# EAGLE schematic rc2usb_led (EAGLE 6.3)
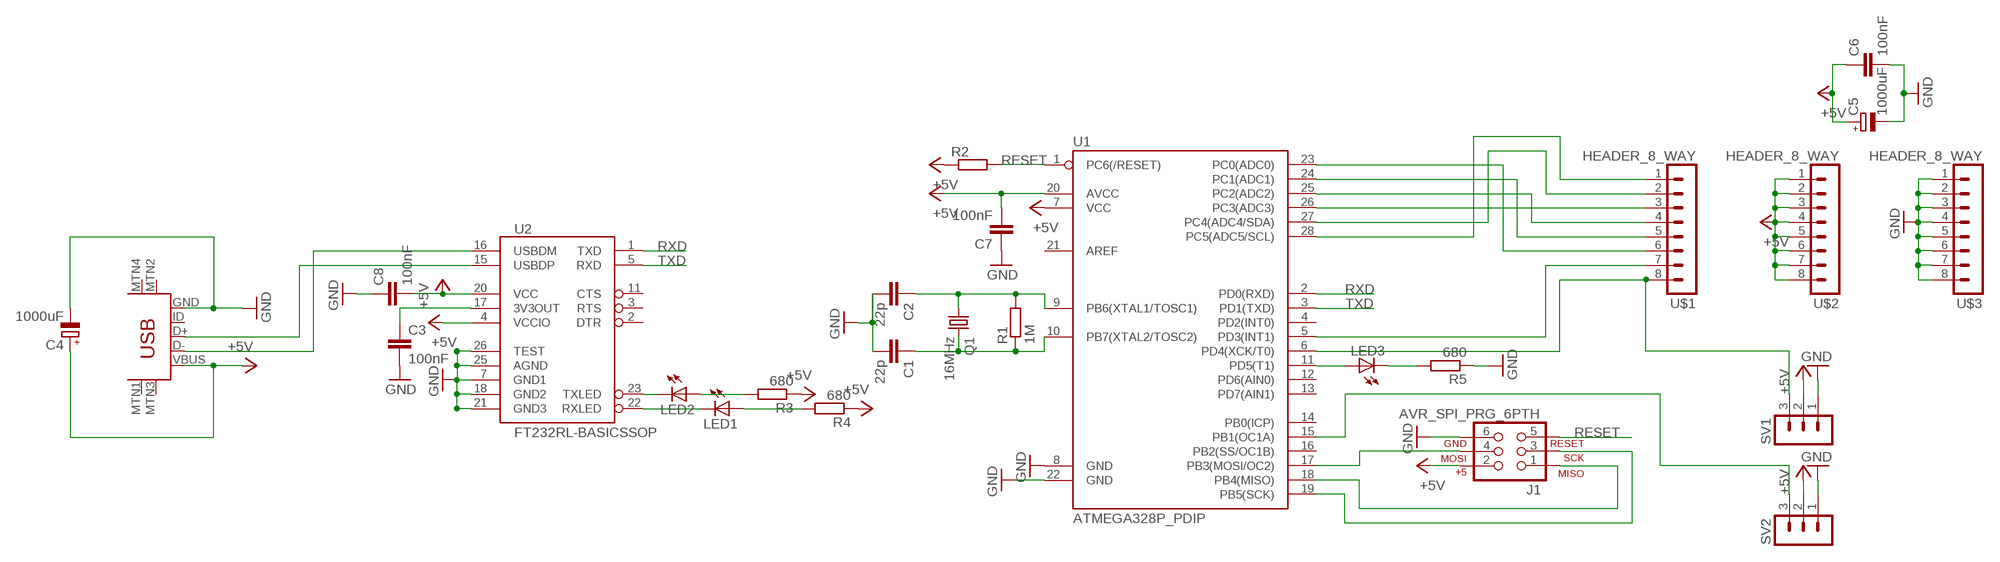
[diagram p0: schematic, sheet 1]

## Parts
C1  22p  C-EU025-040X050  [C025-040X050]
C2  22p  C-EU025-040X050  [C025-040X050]
C3  100nF  C-EU025-030X050  [C025-030X050]
C4  1000uF  CPOL-EUE5-10.5  [E5-10,5]
C5  1000uF  CPOL-EUE5-10.5  [E5-10,5]
C6  100nF  C-EU025-030X050  [C025-030X050]
C7  100nF  C-EU025-030X050  [C025-030X050]
C8  100nF  C-EU025-030X050  [C025-030X050]
J1  AVR_SPI_PRG_6PTH  [2X3]
LED1  LED5MM  [LED5MM]
LED2  LED5MM  [LED5MM]
LED3  LED5MM  [LED5MM]
Q1  16MHz  CRYSTALHC49U70  [HC49U70]
R1  1M  R-EU_0207/10  [0207/10]
R2  R-EU_0207/10  [0207/10]
R3  680  R-EU_0207/10  [0207/10]
R4  680  R-EU_0207/10  [0207/10]
R5  680  R-EU_0207/10  [0207/10]
SV1  MA03-1  [MA03-1]
SV2  MA03-1  [MA03-1]
U1  ATMEGA328P_PDIP  [DIL28-3]
U2  FT232RL-BASICSSOP  [SSOP28DB]
U$1  HEADER_8_WAY  [HEADER_8_WAY]
U$2  HEADER_8_WAY  [HEADER_8_WAY]
U$3  HEADER_8_WAY  [HEADER_8_WAY]
U$4  USB-MINIB-5PIN  [USB-MINIB]

## Nets
+5V: C4.+ C5.+ C6.1 C7.2 C8.2 J1.2 R2.1 R3.1 R4.1 SV1.2 SV2.2 U1.7(VCC) U1.20(AVCC) U2.4(VCCIO) U2.20(VCC) U$2.1 U$2.2 U$2.3 U$2.4 U$2.5 U$2.6 U$2.7 U$2.8 U$4.VBUS
GND: C1.2 C2.2 C3.2 C4.- C5.- C6.2 C7.1 C8.1 J1.6 R5.1 SV1.1 SV2.1 U1.8(GND) U1.22(GND) U2.7(GND1) U2.18(GND2) U2.21(GND3) U2.25(AGND) U2.26(TEST) U$3.1 U$3.2 U$3.3 U$3.4 U$3.5 U$3.6 U$3.7 U$3.8 U$4.GND
N$1: C2.1 Q1.1 R1.2 U1.9(PB6(XTAL1/TOSC1))
N$2: C1.1 Q1.2 R1.1 U1.10(PB7(XTAL2/TOSC2))
N$3: J1.4 U1.17(PB3(MOSI/OC2))
N$4: J1.1 U1.18(PB4(MISO))
N$5: J1.3 U1.19(PB5(SCK))
N$6: U2.15(USBDP) U$4.D+
N$7: U2.16(USBDM) U$4.D-
N$8: U1.24(PC1(ADC1)) U$1.5
N$9: C3.1 U2.17(3V3OUT)
N$10: LED2.K(C) U2.23(TXLED)
N$11: LED2.A R3.2
N$12: LED1.K(C) U2.22(RXLED)
N$13: LED1.A R4.2
N$14: U1.25(PC2(ADC2)) U$1.4
N$15: U1.26(PC3(ADC3)) U$1.3
N$16: U1.23(PC0(ADC0)) U$1.6
N$17: U1.27(PC4(ADC4/SDA)) U$1.2
N$18: U1.28(PC5(ADC5/SCL)) U$1.1
N$19: U1.5(PD3(INT1)) U$1.7
N$20: SV1.3 U1.6(PD4(XCK/T0)) U$1.8
N$21: LED3.A U1.11(PD5(T1))
N$22: SV2.3 U1.15(PB1(OC1A))
N$23: LED3.K(C) R5.2
RESET: J1.5 R2.2 U1.1(PC6(/RESET))
RXD: U1.2(PD0(RXD)) U2.1(TXD)
TXD: U1.3(PD1(TXD)) U2.5(RXD)
Unconnected: U1.4(PD2(INT0)) U1.12(PD6(AIN0)) U1.13(PD7(AIN1)) U1.14(PB0(ICP)) U1.16(PB2(SS/OC1B)) U1.21(AREF) U2.2(DTR) U2.3(RTS) U2.11(CTS) U$4.ID U$4.MTN1(MTN2) U$4.MTN2(MTN3) U$4.MTN3(MTN1) U$4.MTN4

## Library data of the parts
C1 C2 = resistor:C-EU: CAPACITOR, European symbol
C3 C6-C8 = rcl:C-EU: CAPACITOR, European symbol
C4 C5 = rcl:CPOL-EU: POLARIZED CAPACITOR, European symbol
J1 = SparkFun-Connectors:AVR_SPI_PRG_6: AVR ISP 6 Pin This is the reduced ISP connector for AVR programming. Common on Arduino. This footprint will take up less PCB space and can be used with a 10-pin to 6-pin adapter such as SKU: BOB-08508
LED1-LED3 = led:LED: LED OSRAM: - CHIPLED LG R971, LG N971, LY N971, LG Q971, LY Q971, LO R971, LY R971 LH N974, LH R974 LS Q976, LO Q976, LY Q976 LO Q996 - Hyper CHIPLED LW Q18S LB Q993, LB Q99A, LB R99A - SideLED LS A670, LO A670, LY A670, LG A670, LP A670 LB A673, LV A673, LT A673, LW A673 LH A674 LY A675 LS A676, LA A676, LO A676, LY A676, LW A676 LS A679, LY A679, LG A679 - Hyper Micro SIDELED® LS Y876, LA Y876, LO Y876, LY Y876 LT Y87S - SmartLED LW L88C, LW L88S LB L89C, LB L89S, LG L890 LS L89K, LO L89K, LY L89K LS L896, LA L896, LO L896, LY L896 - TOPLED LS T670, LO T670, LY T670, LG T670, LP T670 LSG T670, LSP T670, LSY T670, LOP T670, LYG T670 LG T671, LOG T671, LSG T671 LB T673, LV T673, LT T673, LW T673 LH T674 LS T676, LA T676, LO T676, LY T676, LB T676, LH T676, LSB T676, LW T676 LB T67C, LV T67C, LT T67C, LS T67K, LO T67K, LY T67K, LW E67C LS E67B, LA E67B, LO E67B, LY E67B, LB E67C, LV E67C, LT E67C LW T67C LS T679, LY T679, LG T679 LS T770, LO T770, LY T770, LG T770, LP T770 LB T773, LV T773, LT T773, LW T773 LH T774 LS E675, LA E675, LY E675, LS T675 LS T776, LA T776, LO T776, LY T776, LB T776 LHGB T686 LT T68C, LB T68C - Hyper Mini TOPLED® LB M676 - Mini TOPLED Santana® LG M470 LS M47K, LO M47K, LY M47K Source: http://www.osram.convergy.de LUXEON: - LUMILED® LXK2-PW12-R00, LXK2-PW12-S00, LXK2-PW14-U00, LXK2-PW14-V00 LXK2-PM12-R00, LXK2-PM12-S00, LXK2-PM14-U00 LXK2-PE12-Q00, LXK2-PE12-R00, LXK2-PE12-S00, LXK2-PE14-T00, LXK2-PE14-U00 LXK2-PB12-K00, LXK2-PB12-L00, LXK2-PB12-M00, LXK2-PB14-N00, LXK2-PB14-P00, LXK2-PB14-Q00 LXK2-PR12-L00, LXK2-PR12-M00, LXK2-PR14-Q00, LXK2-PR14-R00 LXK2-PD12-Q00, LXK2-PD12-R00, LXK2-PD12-S00 LXK2-PH12-R00, LXK2-PH12-S00 LXK2-PL12-P00, LXK2-PL12-Q00, LXK2-PL12-R00 Source: www.luxeon.com KINGBRIGHT: KA-3528ASYC Source: www.kingbright.com
Q1 = crystal:CRYSTAL: CRYSTAL; OC_FARNELL: unknown; OC_NEWARK: unknown
R1-R5 = resistor:R-EU_: RESISTOR, European symbol
SV1 SV2 = con-lstb:MA03-1: PIN HEADER; OC_FARNELL: unknown; OC_NEWARK: unknown
U1 = SparkFun-DigitalIC:ATMEGA328P_PDIP: uC used in the Arduino 32kb flash, 1k EEPROM, 2k SRAM This is the through-hole version of this chip.
U2 = SparkFun-DigitalIC:FT232RL-BASIC: USB UART This is the simplified version of the FT232RL unit. Only what you need, nothing you don't. Spark Fun Electronics SKU : COM-00650
U$1-U$3 = rc2usb:HEADER_8_WAY
U$4 = SparkFun-Connectors:USB-MINIB: Mini-USB "B" connector with 5th pin broken out. Created new symbol breaking out 5th "ID" pin in mini/micro USB connector spec. See: http://en.wikipedia.org/wiki/Mini_usb#Cables. Uses same footprint as 4-pin symbol. Also added pins to connect to mounting / shield pads if required (probably not generally needed as signals aren't shielded once they leave the connector).